# EAGLE design avt953 (EAGLE 6.6.0)
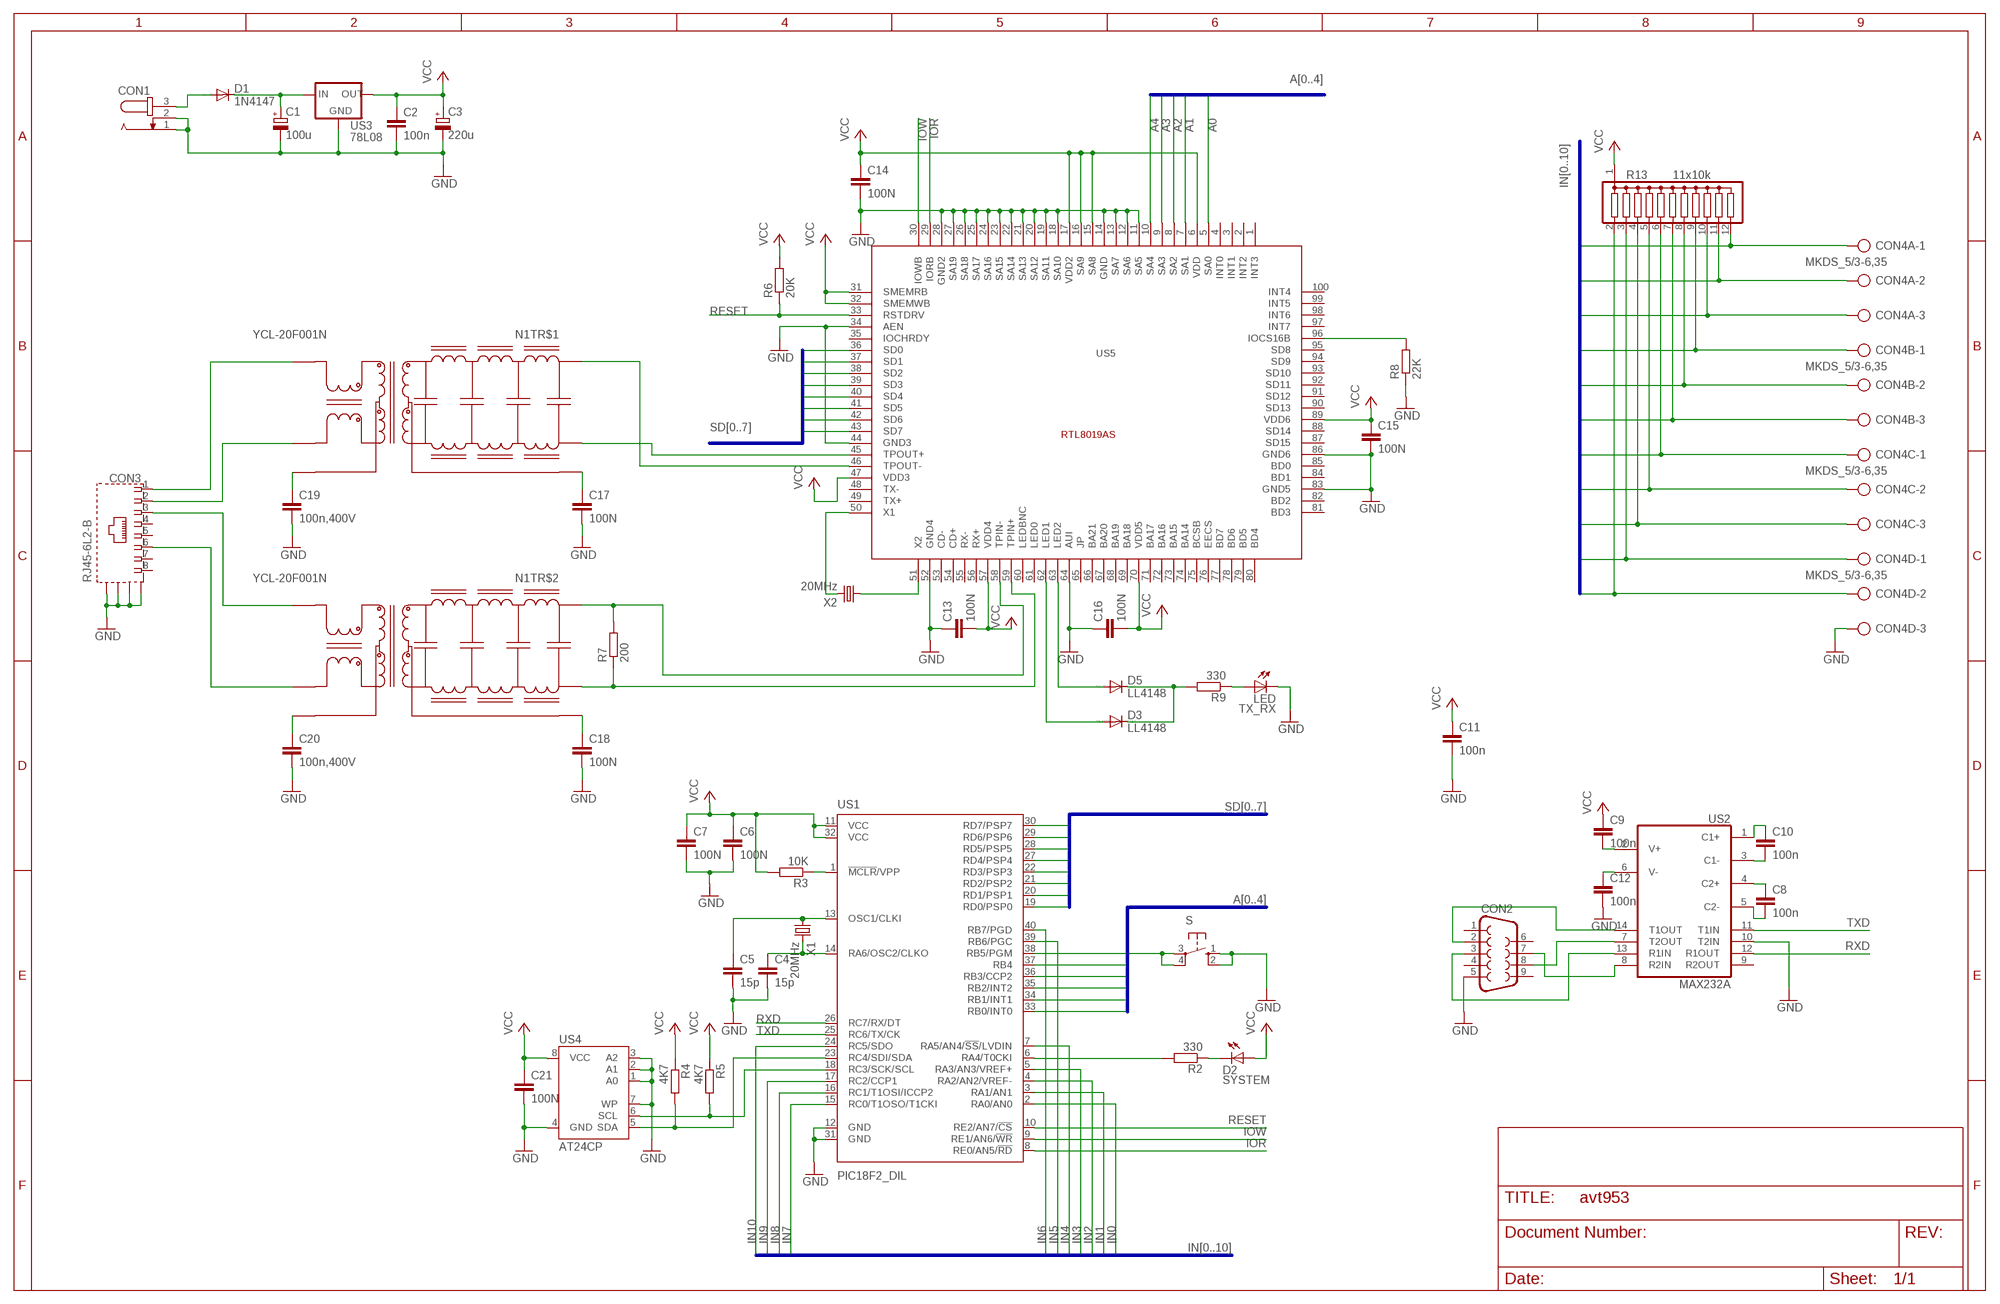
[diagram p0: schematic, sheet 1]

## Parts
C1  100u  CPOL-EUTT2D5  [TT2D5]
C2  100n  C-EUC1206K  [C1206K]
C3  220u  CPOL-EUTT2D5  [TT2D5]
C4  15p  C-EUC1206K  [C1206K]
C5  15p  C-EUC1206K  [C1206K]
C6  100N  C-EUC1206K  [C1206K]
C7  100N  C-EUC1206K  [C1206K]
C8  100n  C-EUC1206K  [C1206K]
C9  100n  C-EUC1206K  [C1206K]
C10  100n  C-EUC1206K  [C1206K]
C11  100n  C-EUC1206K  [C1206K]
C12  100n  C-EUC1206K  [C1206K]
C13  100N  C-EUC1206K  [C1206K]
C14  100N  C-EUC1206K  [C1206K]
C15  100N  C-EUC1206K  [C1206K]
C16  100N  C-EUC1206K  [C1206K]
C17  100N  C-EUC1206K  [C1206K]
C18  100N  C-EUC1206K  [C1206K]
C19  100n,400V  C-EU075-032X103  [C075-032X103]
C20  100n,400V  C-EU075-032X103  [C075-032X103]
C21  100N  C-EUC1206K  [C1206K]
CON1  JACK-PLUG0  [SPC4077]
CON2  F09HP  [F09HP]
CON3  RJ45-6L2-B  [RJ45-SHIELD2]
CON4A  MKDS_5/3-6,35  [MKDS_5/3-635]
CON4B  MKDS_5/3-6,35  [MKDS_5/3-635]
CON4C  MKDS_5/3-6,35  [MKDS_5/3-635]
CON4D  MKDS_5/3-6,35  [MKDS_5/3-635]
D1  1N4147  1N4148DO35-10  [DO35-10]
D2  SYSTEM  LED5MM  [LED5MM]
D3  LL4148  CGRM4001-G  [SOD-123_MINI-SMA]
D5  LL4148  CGRM4001-G  [SOD-123_MINI-SMA]
LED  TX_RX  LED5MM  [LED5MM]
N1  YCL-20F001N  [DIP]
R2  330  R-EU_M3216  [M3216]
R3  10K  R-EU_M3216  [M3216]
R4  4K7  R-EU_M3216  [M3216]
R5  4K7  R-EU_M3216  [M3216]
R6  20K  R-EU_M3216  [M3216]
R7  200  R-EU_M3216  [M3216]
R8  22K  R-EU_M3216  [M3216]
R9  330  R-EU_M3216  [M3216]
R13  11x10k  G11R  [SIL12]
S  10-XX  [B3F-10XX]
US1  PIC18F2_DIL  [DIL40]
US2  MAX232A  MAX232ECWE  [SO16L]
US3  78L08  78XXL  [78XXL]
US4  AT24CP  [DIL08]
US5  RTL8019AS  [RTL8019AS]
X1  20MHz  CRYSTALHC49S  [HC49/S]
X2  20MHz  CRYSTALHC49S  [HC49/S]

## Nets
A0: US1.33(RB0/INT0) US5.5(SA0)
A1: US1.34(RB1/INT1) US5.7(SA1)
A2: US1.35(RB2/INT2) US5.8(SA2)
A3: US1.36(RB3/CCP2) US5.9(SA3)
A4: US1.37(RB4) US5.10(SA4)
GND: C1.- C2.2 C3.- C4.2 C5.2 C6.2 C7.2 C11.2 C12.2 C13.1 C14.2 C15.2 C16.1 C17.2 C18.2 C19.2 C20.2 C21.2 CON1.1 CON1.2 CON2.5 CON3.S1(S) CON3.S2(S) CON3.S3(S) CON3.S4(S) CON4D.3 LED.K(C) R8.1 S.1(S) S.2(S1) US1.12(GND) US1.31(GND) US2.10(T2IN) US3.GND US4.1(A0) US4.2(A1) US4.3(A2) US4.4(GND) US4.7(WP) US5.11(SA5) US5.12(SA6) US5.13(SA7) US5.14(GND) US5.18(SA10) US5.19(SA11) US5.20(SA12) US5.21(SA13) US5.22(SA14) US5.23(SA15) US5.24(SA16) US5.25(SA17) US5.26(SA18) US5.27(SA19) US5.28(GND2) US5.34(AEN) US5.44(GND3) US5.52(GND4) US5.64(AUI) US5.83(GND5) US5.86(GND6)
IN0: CON4A.1 R13.12 US1.2(RA0/AN0)
IN1: CON4A.2 R13.11 US1.3(RA1/AN1)
IN2: CON4A.3 R13.10 US1.4(RA2/AN2/VREF-)
IN3: CON4B.1 R13.9 US1.5(RA3/AN3/VREF+)
IN4: CON4B.2 R13.8 US1.7(RA5/AN4/!SS!/LVDIN)
IN5: CON4B.3 R13.7 US1.39(RB6/PGC)
IN6: CON4C.1 R13.6 US1.40(RB7/PGD)
IN7: CON4C.2 R13.5 US1.15(RC0/T1OSO/T1CKI)
IN8: CON4C.3 R13.4 US1.16(RC1/T1OSI/ICCP2)
IN9: CON4D.1 R13.3 US1.17(RC2/CCP1)
IN10: CON4D.2 R13.2 US1.24(RC5/SDO)
IOR: US1.8(RE0/AN5/!RD) US5.29(IORB)
IOW: US1.9(RE1/AN6/!WR) US5.30(IOWB)
N$1: C9.2 US2.2(V+)
N$2: C12.1 US2.6(V-)
N$3: C10.2 US2.3(C1-)
N$4: C10.1 US2.1(C1+)
N$5: C8.1 US2.4(C2+)
N$6: C8.2 US2.5(C2-)
N$7: CON2.2 US2.14(T1OUT)
N$8: CON2.8 US2.7(T2OUT)
N$9: CON2.3 US2.13(R1IN)
N$10: CON2.7 US2.8(R2IN)
N$11: CON1.3 D1.A
N$12: C1.+ D1.C US3.IN
N$13: CON3.1 N1.P$16
N$14: CON3.2 N1.P$14
N$15: CON3.3 N1.P$11
N$16: CON3.6 N1.P$9
N$17: C19.1 N1.P$15
N$18: C20.1 N1.P$10
N$19: C18.1 N1.P$7
N$20: C17.1 N1.P$2
N$21: N1.P$3 US5.45(TPOUT+)
N$22: N1.P$8 R7.1 US5.59(TPIN+)
N$23: N1.P$1 US5.46(TPOUT-)
N$24: US5.50(X1) X2.2
N$25: N1.P$6 R7.2 US5.58(TPIN-)
N$26: D3.A US5.62(LED1)
N$27: R8.2 US5.96(IOCS16B)
N$28: US5.51(X2) X2.1
N$29: D5.A US5.63(LED2)
N$30: D3.C D5.C R9.2
N$31: LED.A R9.1
N$32: C5.1 US1.13(OSC1/CLKI) X1.1
N$33: C4.1 US1.14(RA6/OSC2/CLKO) X1.2
N$34: R4.2 US1.23(RC4/SDI/SDA) US4.5(SDA)
N$35: R3.1 US1.1(!MCLR!/VPP)
N$36: R2.2 US1.6(RA4/T0CKI)
N$37: R5.2 US1.18(RC3/SCK/SCL) US4.6(SCL)
N$38: D2.K(C) R2.1
N$40: S.3(P) S.4(P1) US1.38(RB5/PGM)
RESET: R6.1 US1.10(RE2/AN7/!CS) US5.33(RSTDRV)
RXD: US1.26(RC7/RX/DT) US2.12(R1OUT)
SD0: US1.19(RD0/PSP0) US5.36(SD0)
SD1: US1.20(RD1/PSP1) US5.37(SD1)
SD2: US1.21(RD2/PSP2) US5.38(SD2)
SD3: US1.22(RD3/PSP3) US5.39(SD3)
SD4: US1.27(RD4/PSP4) US5.40(SD4)
SD5: US1.28(RD5/PSP5) US5.41(SD5)
SD6: US1.29(RD6/PSP6) US5.42(SD6)
SD7: US1.30(RD7/PSP7) US5.43(SD7)
TXD: US1.25(RC6/TX/CK) US2.11(T1IN)
VCC: C2.1 C3.+ C6.1 C7.1 C9.1 C11.1 C13.2 C14.1 C15.1 C16.2 C21.1 D2.A R3.2 R4.1 R5.1 R6.2 R13.1 US1.11(VCC) US1.32(VCC) US3.OUT US4.8(VCC) US5.6(VDD) US5.15(SA8) US5.16(SA9) US5.17(VDD2) US5.31(SMEMRB) US5.32(SMEMWB) US5.47(VDD3) US5.57(VDD4) US5.70(VDD5) US5.89(VDD6)
Unconnected: CON2.1 CON2.4 CON2.6 CON2.9 CON3.4 CON3.5 CON3.7 CON3.8 US2.9(R2OUT) US5.1(INT3) US5.2(INT2) US5.3(INT1) US5.4(INT0) US5.35(IOCHRDY) US5.48(TX-) US5.49(TX+) US5.53(CD-) US5.54(CD+) US5.55(RX-) US5.56(RX+) US5.60(LEDBNC) US5.61(LED0) US5.65(JP) US5.66(BA21) US5.67(BA20) US5.68(BA19) US5.69(BA18) US5.71(BA17) US5.72(BA16) US5.73(BA15) US5.74(BA14) US5.75(BCSB) US5.76(EECS) US5.77(BD7) US5.78(BD6) US5.79(BD5) US5.80(BD4) US5.81(BD3) US5.82(BD2) US5.84(BD1) US5.85(BD0) US5.87(SD15) US5.88(SD14) US5.90(SD13) US5.91(SD12) US5.92(SD11) US5.93(SD10) US5.94(SD9) US5.95(SD8) US5.97(INT7) US5.98(INT6) US5.99(INT5) US5.100(INT4)

## Buses
IN[0..10]
A[0..4]
SD[0..7]

## Power pins joined to a net without a drawn wire
GND: US2.15(GND)
VCC: US2.16(VCC)

## Library data of the parts
C1 C3 = resistor:CPOL-EU: POLARIZED CAPACITOR, European symbol
C2 C4-C21 = resistor:C-EU: CAPACITOR, European symbol
CON1 = con-jack:JACK-PLUG: DC POWER JACK Power Jack, DC, Right Angle, Through Hole, Rated 5A at 16VDC, PC Terminals Distributor: Farnell (www.Farnell.de) Drawing: 84N1161.pdf / 84N1162.pdf Manufacturer: SPC Technology (www.spctechnology.com) Type: SPC4077 / SPC 4078; OC_FARNELL: unknown; OC_NEWARK: unknown
CON2 = con-subd:F09: SUB-D; OC_FARNELL: unknown; OC_NEWARK: unknown
CON3 = con-tycoelectronics:RJ45*2: RJ45 Low Profile Shield Type 2 For all RJ45 L, LC, LCT and X Series Models Source: www.tycoelectronics.com .. ENG_DS_1654001_1099_RJ_L_0507.pdf; MPN: RJ45-6L2-B; OC_FARNELL: unknown; OC_NEWARK: 16R6096
CON4A CON4B CON4C CON4D = con-phoenix-mkds_5:MKDS_5/3-: MKDS 5/3-6,35 Source: PHOENIX CONTACT; MF: FARNELL; MPN: 1714968; OC_FARNELL: 3704695; OC_NEWARK: 71C4092
D1 = diode:1N4148: DIODE high speed (Philips)
D2 LED = led:LED: LED OSRAM: - CHIPLED LG R971, LG N971, LY N971, LG Q971, LY Q971, LO R971, LY R971 LH N974, LH R974 LS Q976, LO Q976, LY Q976 LO Q996 - Hyper CHIPLED LW Q18S LB Q993, LB Q99A, LB R99A - SideLED LS A670, LO A670, LY A670, LG A670, LP A670 LB A673, LV A673, LT A673, LW A673 LH A674 LY A675 LS A676, LA A676, LO A676, LY A676, LW A676 LS A679, LY A679, LG A679 - Hyper Micro SIDELED® LS Y876, LA Y876, LO Y876, LY Y876 LT Y87S - SmartLED LW L88C, LW L88S LB L89C, LB L89S, LG L890 LS L89K, LO L89K, LY L89K LS L896, LA L896, LO L896, LY L896 - TOPLED LS T670, LO T670, LY T670, LG T670, LP T670 LSG T670, LSP T670, LSY T670, LOP T670, LYG T670 LG T671, LOG T671, LSG T671 LB T673, LV T673, LT T673, LW T673 LH T674 LS T676, LA T676, LO T676, LY T676, LB T676, LH T676, LSB T676, LW T676 LB T67C, LV T67C, LT T67C, LS T67K, LO T67K, LY T67K, LW E67C LS E67B, LA E67B, LO E67B, LY E67B, LB E67C, LV E67C, LT E67C LW T67C LS T679, LY T679, LG T679 LS T770, LO T770, LY T770, LG T770, LP T770 LB T773, LV T773, LT T773, LW T773 LH T774 LS E675, LA E675, LY E675, LS T675 LS T776, LA T776, LO T776, LY T776, LB T776 LHGB T686 LT T68C, LB T68C - Hyper Mini TOPLED® LB M676 - Mini TOPLED Santana® LG M470 LS M47K, LO M47K, LY M47K Source: http://www.osram.convergy.de LUXEON: - LUMILED® LXK2-PW12-R00, LXK2-PW12-S00, LXK2-PW14-U00, LXK2-PW14-V00 LXK2-PM12-R00, LXK2-PM12-S00, LXK2-PM14-U00 LXK2-PE12-Q00, LXK2-PE12-R00, LXK2-PE12-S00, LXK2-PE14-T00, LXK2-PE14-U00 LXK2-PB12-K00, LXK2-PB12-L00, LXK2-PB12-M00, LXK2-PB14-N00, LXK2-PB14-P00, LXK2-PB14-Q00 LXK2-PR12-L00, LXK2-PR12-M00, LXK2-PR14-Q00, LXK2-PR14-R00 LXK2-PD12-Q00, LXK2-PD12-R00, LXK2-PD12-S00 LXK2-PH12-R00, LXK2-PH12-S00 LXK2-PL12-P00, LXK2-PL12-Q00, LXK2-PL12-R00 Source: www.luxeon.com KINGBRIGHT: KA-3528ASYC Source: www.kingbright.com
D3 D5 = diode:CGRM400*-G: Molded plasitc,JEDEC SOD-123/Mini SMA Source: Comchip CGRM4001-G.pdf
N1 = trafo:YCL-20F001?: YCL-20F00(N)
R2-R9 = resistor:R-EU_: RESISTOR, European symbol
R13 = resistor-sil:G11R: SIL RESISTOR; OC_FARNELL: unknown; OC_NEWARK: unknown
S = switch-omron:10-XX: OMRON SWITCH; MPN: B3F-1000; OC_FARNELL: 176432; OC_NEWARK: 36M3542
US1 = microchip-custom:PIC18F*2_DIL
US2 = maxim:MAX232ECWE: RS232 TRANSCEIVER; MF: MAXIM; MPN: MAX232ECWE+; OC_FARNELL: 9724435; OC_NEWARK: 67K4440
US3 = v-reg:78XXL: VOLTAGE REGULATOR
US4 = atmel:AT24C*: 2-wire serial EEPROM; MPN: AT24C1024BW-SH-B; OC_FARNELL: 1362646; OC_NEWARK: 03P2044
US5 = rtl8019as:RTL8019AS
X1 X2 = crystal:CRYSTAL: CRYSTAL; OC_FARNELL: 1667008; OC_NEWARK: unknown

## Board
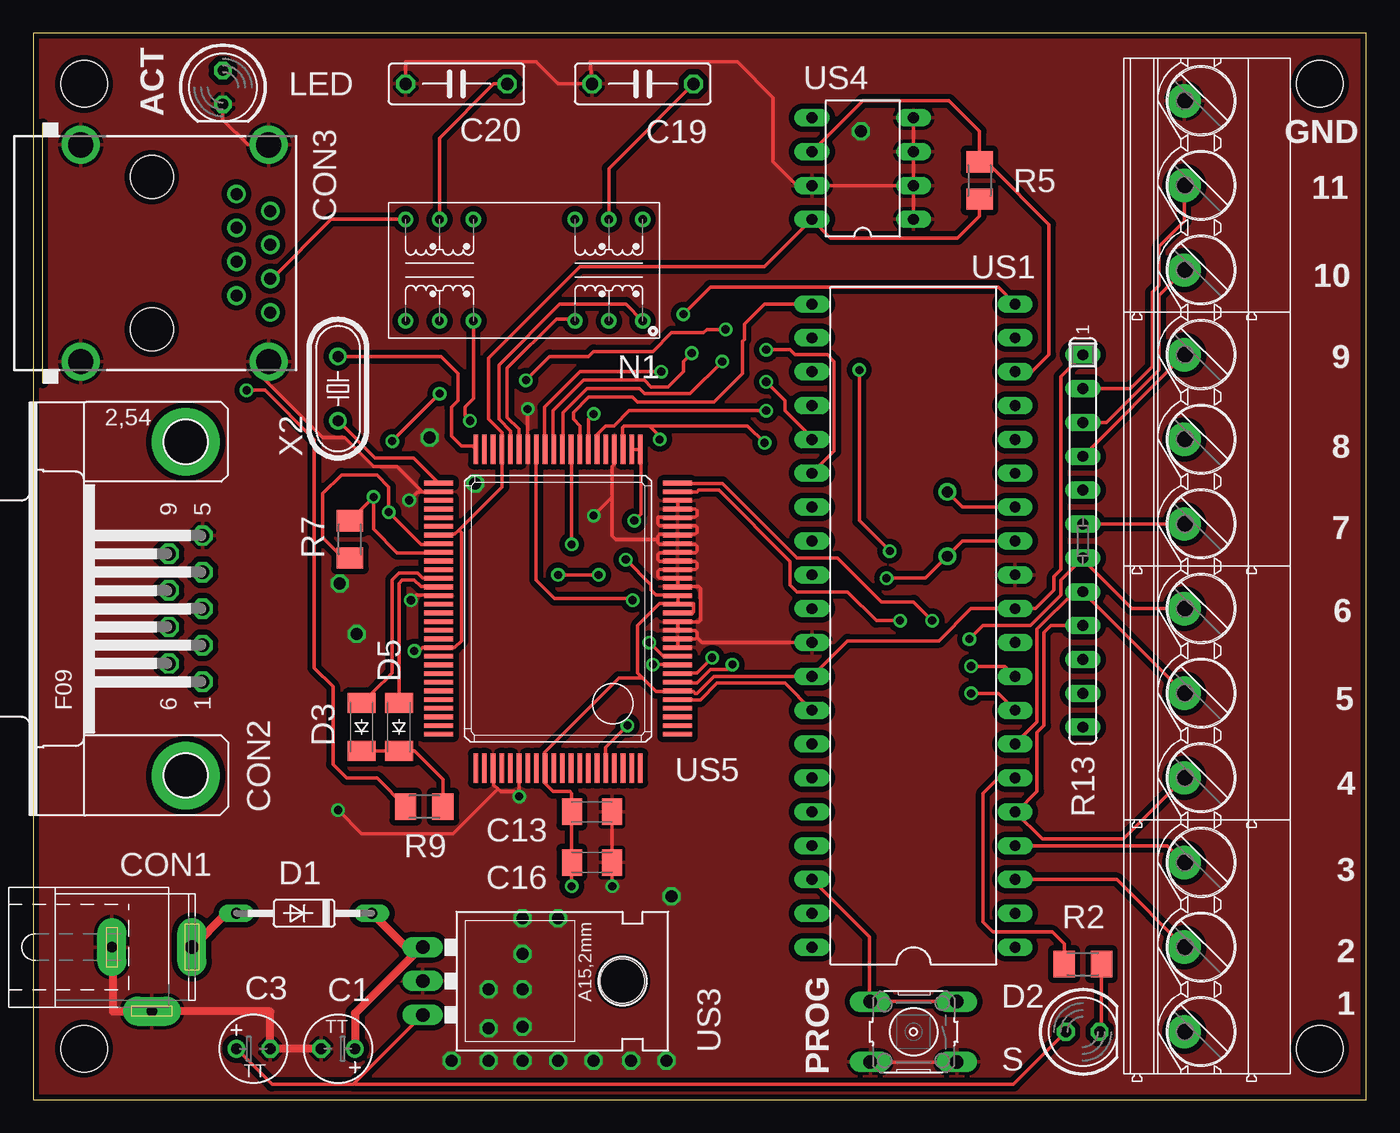
[diagram p1: board, top side]
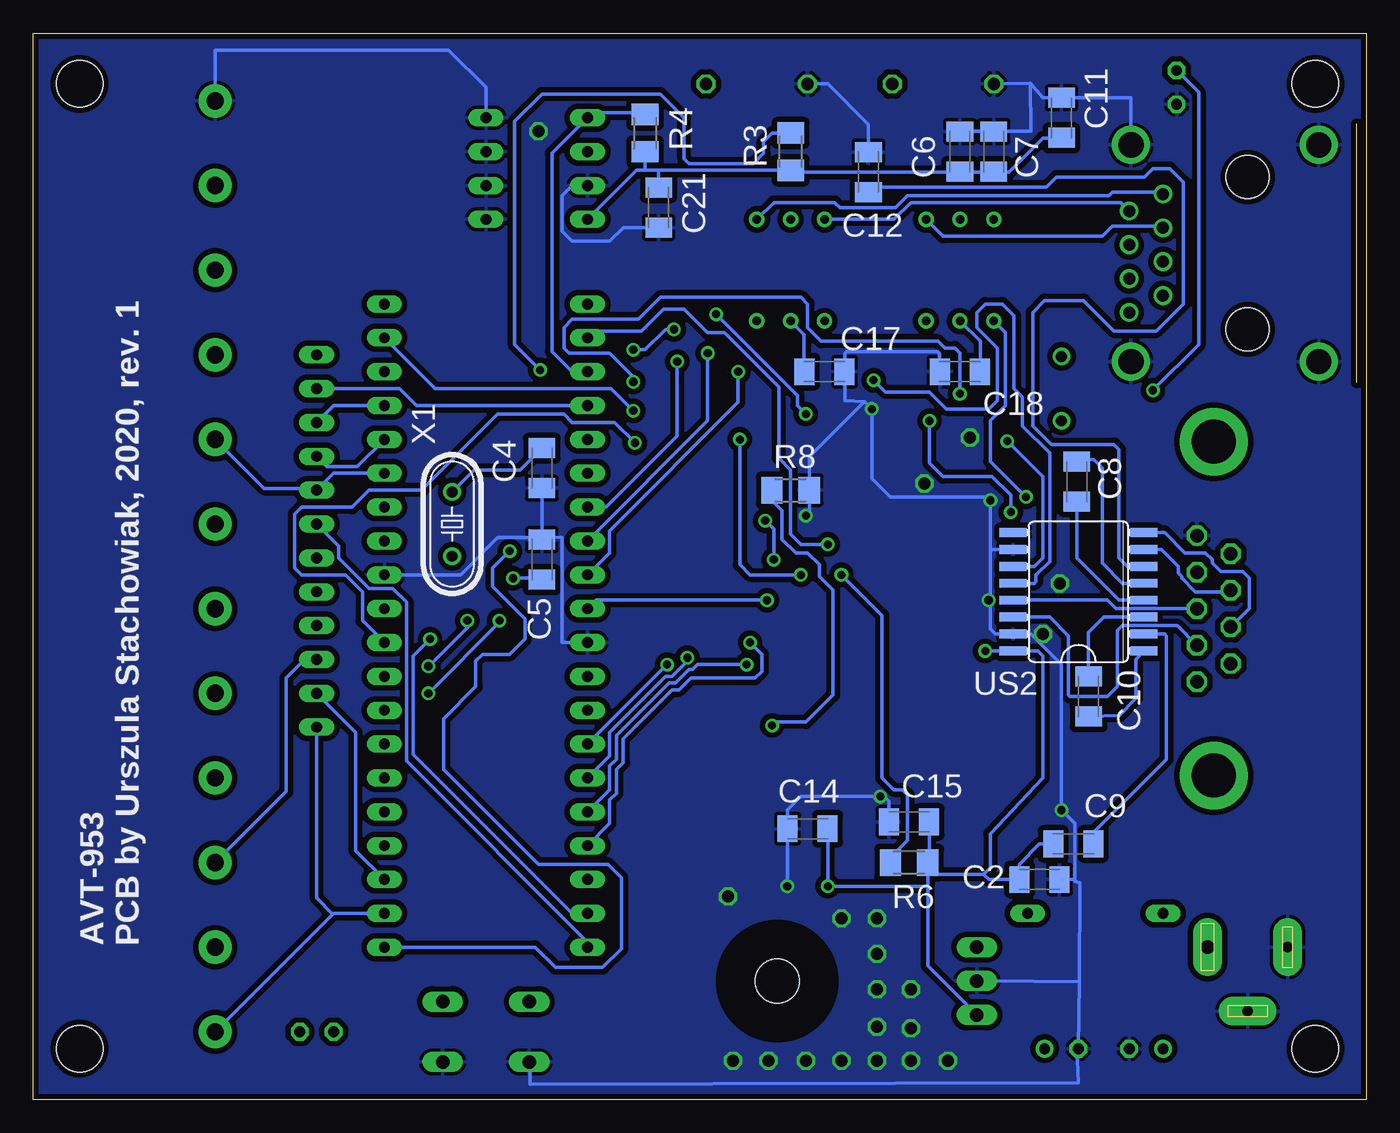
[diagram p2: board, bottom side, seen from below]

Size 100 x 80 mm. Coordinates in mm from the lower left corner, seen from the top.
Outline: 0,0 100,0 100,80 0,80 0,0
Copper layers (1*16): Top 0.035mm / dielectric 1.5mm / Bottom 0.035mm
Design rules "allpcb": minimum track width 6mil, minimum drill 0.25mm, track to track 6mil, track to pad 6mil, pad to pad 6mil, via to via 17mil, smd to smd 0.1mm, copper to edge 0.3mm, drill to drill 8mil, minimum pad ring 10mil, minimum via ring 8mil, stop-mask expansion 4mil, vias tented up to drill 3mm, thermal gap 10mil
Holes 3.5 mm at 3.81,76.2 96.52,76.2 96.52,3.81 3.81,3.81

### Footprints (pad centres in the part's own frame; a part is rotated, then mirrored left to right if it is on the bottom)
TT2D5 = drill 0.813: + -1.27,0 | drill 0.813 octagon: - 1.27,0
C1206K = smd 1.5 x 2: 1 -1.5,0; 2 1.5,0
C075-032X103 = drill 0.914 octagon: 1 -3.81,0; 2 3.81,0
SPC4077 = drill 0.8 pad 2.184 long: 1 -3,0; 2 0,-4.8 | drill 1 pad 2.184 long: 3 3,0
F09HP = drill 1.016 octagon: 1 -5.486,-1.27; 2 -2.743,-1.27; 3 0,-1.27; 4 2.743,-1.27; 5 5.486,-1.27; 6 -4.115,1.27; 7 -1.372,1.27; 8 1.372,1.27; 9 4.115,1.27 | drill 3.302 pad 5.08: G1 -12.522,0; G2 12.522,0
RJ45-SHIELD2 = drill 0.9 pad 1.4: 1 -4.445,6.35; 2 -3.175,8.89; 3 -1.905,6.35; 4 -0.635,8.89; 5 0.635,6.35; 6 1.905,8.89; 7 3.175,6.35; 8 4.445,8.89 | drill 1.9 pad 2.5: S1 -8.128,-5.33; S2 8.128,-5.33; S3 -8.128,8.76; S4 8.128,8.76 | hole 3.251: -5.715,0; 5.715,0
MKDS_5/3-635 = drill 1.3 pad 2.5: 1 -6.35,0; 2 0,0; 3 6.35,0
DO35-10 = drill 0.813 long: A 5.08,0; C -5.08,0
LED5MM = drill 0.813 octagon: A -1.27,0; K 1.27,0
SOD-123_MINI-SMA = smd 1.5 x 2.1: A 1.8,0; C -1.8,0
DIP = drill 0.635: P$1 -8.89,3.81; P$2 -6.35,3.81; P$3 -3.81,3.81; P$6 3.81,3.81; P$7 6.35,3.81; P$8 8.89,3.81; P$9 8.89,-3.81; P$10 6.35,-3.81; P$11 3.81,-3.81; P$14 -3.81,-3.81; P$15 -6.35,-3.81; P$16 -8.89,-3.81
M3216 = smd 1.6 x 2: 1 -1.4,0; 2 1.4,0
SIL12 = drill 0.813 long: 1 -13.97,0; 2 -11.43,0; 3 -8.89,0; 4 -6.35,0; 5 -3.81,0; 6 -1.27,0; 7 1.27,0; 8 3.81,0; 9 6.35,0; 10 8.89,0; 11 11.43,0; 12 13.97,0
B3F-10XX = drill 1.016 long: 1 -3.251,2.261; 2 3.251,2.261; 3 -3.251,-2.261; 4 3.251,-2.261
DIL40 = drill 0.813 long: 1 -24.13,-7.62; 2 -21.59,-7.62; 3 -19.05,-7.62; 4 -16.51,-7.62; 5 -13.97,-7.62; 6 -11.43,-7.62; 7 -8.89,-7.62; 8 -6.35,-7.62; 9 -3.81,-7.62; 10 -1.27,-7.62; 11 1.27,-7.62; 12 3.81,-7.62; 13 6.35,-7.62; 14 8.89,-7.62; 15 11.43,-7.62; 16 13.97,-7.62; 17 16.51,-7.62; 18 19.05,-7.62; 19 21.59,-7.62; 20 24.13,-7.62; 21 24.13,7.62; 22 21.59,7.62; 23 19.05,7.62; 24 16.51,7.62; 25 13.97,7.62; 26 11.43,7.62; 27 8.89,7.62; 28 6.35,7.62; 29 3.81,7.62; 30 1.27,7.62; 31 -1.27,7.62; 32 -3.81,7.62; 33 -6.35,7.62; 34 -8.89,7.62; 35 -11.43,7.62; 36 -13.97,7.62; 37 -16.51,7.62; 38 -19.05,7.62; 39 -21.59,7.62; 40 -24.13,7.62
SO16L = smd 0.66 x 2.032: 1 -4.445,-4.902; 2 -3.175,-4.902; 3 -1.905,-4.902; 4 -0.635,-4.902; 5 0.635,-4.902; 6 1.905,-4.902; 7 3.175,-4.902; 8 4.445,-4.902; 9 4.445,4.902; 10 3.175,4.902; 11 1.905,4.902; 12 0.635,4.902; 13 -0.635,4.902; 14 -1.905,4.902; 15 -3.175,4.902; 16 -4.445,4.902
78XXL = drill 1.016 long: GND 0,-3.81; IN -2.54,-3.81; OUT 2.54,-3.81 | hole 3.302: 0,11.176
DIL08 = drill 0.813 long: 1 -3.81,-3.81; 2 -1.27,-3.81; 3 1.27,-3.81; 4 3.81,-3.81; 5 3.81,3.81; 6 1.27,3.81; 7 -1.27,3.81; 8 -3.81,3.81
RTL8019AS = smd 0.35 x 2.2: 1 -9.425,-8.965; 2 -8.775,-8.965; 3 -8.125,-8.965; 4 -7.475,-8.965; 5 -6.825,-8.965; 6 -6.175,-8.965; 7 -5.525,-8.965; 8 -4.875,-8.965; 9 -4.225,-8.965; 10 -3.575,-8.965; 11 -2.925,-8.965; 12 -2.275,-8.965; 13 -1.625,-8.965; 14 -0.975,-8.965; 15 -0.325,-8.965; 16 0.325,-8.965; 17 0.975,-8.965; 18 1.625,-8.965; 19 2.275,-8.965; 20 2.925,-8.965; 21 3.575,-8.965; 22 4.225,-8.965; 23 4.875,-8.965; 24 5.525,-8.965; 25 6.175,-8.965; 26 6.825,-8.965; 27 7.475,-8.965; 28 8.125,-8.965; 29 8.775,-8.965; 30 9.425,-8.965; 51 9.425,8.965; 52 8.775,8.965; 53 8.125,8.965; 54 7.475,8.965; 55 6.825,8.965; 56 6.175,8.965; 57 5.525,8.965; 58 4.875,8.965; 59 4.225,8.965; 60 3.575,8.965; 61 2.925,8.965; 62 2.275,8.965; 63 1.625,8.965; 64 0.975,8.965; 65 0.325,8.965; 66 -0.325,8.965; 67 -0.975,8.965; 68 -1.625,8.965; 69 -2.275,8.965; 70 -2.925,8.965; 71 -3.575,8.965; 72 -4.225,8.965; 73 -4.875,8.965; 74 -5.525,8.965; 75 -6.175,8.965; 76 -6.825,8.965; 77 -7.475,8.965; 78 -8.125,8.965; 79 -8.775,8.965; 80 -9.425,8.965 | smd 2.2 x 0.35: 31 11.965,-6.175; 32 11.965,-5.525; 33 11.965,-4.875; 34 11.965,-4.225; 35 11.965,-3.575; 36 11.965,-2.925; 37 11.965,-2.275; 38 11.965,-1.625; 39 11.965,-0.975; 40 11.965,-0.325; 41 11.965,0.325; 42 11.965,0.975; 43 11.965,1.625; 44 11.965,2.275; 45 11.965,2.925; 46 11.965,3.575; 47 11.965,4.225; 48 11.965,4.875; 49 11.965,5.525; 50 11.965,6.175; 81 -11.965,6.175; 82 -11.965,5.525; 83 -11.965,4.875; 84 -11.965,4.225; 85 -11.965,3.575; 86 -11.965,2.925; 87 -11.965,2.275; 88 -11.965,1.625; 89 -11.965,0.975; 90 -11.965,0.325; 91 -11.965,-0.325; 92 -11.965,-0.975; 93 -11.965,-1.625; 94 -11.965,-2.275; 95 -11.965,-2.925; 96 -11.965,-3.575; 97 -11.965,-4.225; 98 -11.965,-4.875; 99 -11.965,-5.525; 100 -11.965,-6.175
HC49/S = drill 0.813: 1 -2.413,0; 2 2.413,0

### Placement (x,y rotation side)
C1  22.86,3.81 180 top
C2  24.51,16.51 0 bottom
C3  16.51,3.81 0 top
C4  61.85,47.37 270 bottom
C5  61.85,40.51 90 bottom
C6  30.48,71.12 90 bottom
C7  27.94,71.12 90 bottom
C8  21.72,46.35 90 bottom
C9  21.97,19.18 0 bottom
C10  20.83,30.23 90 bottom
C11  22.86,73.66 90 bottom
C12  37.34,69.6 90 bottom
C13  41.91,21.59 180 top
C14  41.91,20.32 180 bottom
C15  34.29,20.83 180 bottom
C16  41.91,17.78 180 top
C17  40.64,54.61 0 bottom
C18  30.48,54.61 180 bottom
C19  45.72,76.2 180 top
C20  31.75,76.2 180 top
C21  53.09,66.93 270 bottom
CON1  8.89,11.43 0 top
CON2  11.43,36.83 90 top
CON3  8.89,63.5 270 top
CON4A  86.36,11.43 90 top
CON4B  86.36,30.48 90 top
CON4C  86.36,49.53 90 top
CON4D  86.36,68.58 90 top
D1  20.32,13.97 180 top
D2  78.74,5.08 0 top
D3  24.64,27.94 90 top
D5  27.43,27.94 90 top
LED  14.22,75.95 270 top
N1  36.83,62.23 180 top
R2  78.74,10.16 180 top
R3  43.18,71.12 270 bottom
R4  54.1,72.52 90 bottom
R5  70.99,68.96 90 top
R6  34.29,17.78 0 bottom
R7  23.75,42.04 270 top
R8  43.18,45.72 180 bottom
R9  29.34,21.97 0 top
R13  78.74,41.91 270 top
S  66.04,5.08 180 top
US1  66.04,35.56 90 top
US2  21.59,38.1 90 bottom
US3  33.02,8.89 270 top
US4  62.23,69.85 90 top
US5  39.37,36.83 90 top
X1  68.58,43.18 90 bottom
X2  22.86,53.34 90 top

### Tracks (layer width: path | path; a pad name or v marks a point on that pad's centre or on a via)
A0
  Top 0.254: US1.33 56.39,31.24 51.31,31.24 50.04,29.97 48.39,29.97 US5.5
A1  (via drill 0.61)
  Top 0.254: v52.45,32.64 52.07,32.26 50.8,32.26 49.78,31.24 48.39,31.24 US5.7
  Bottom 0.254: US1.34 v52.45,32.64
A2  (via drill 0.61)
  Top 0.254: v50.93,33.15 49.78,32 48.39,32 US5.8
  Bottom 0.254: v50.93,33.15 50.93,32.89 52.07,31.75 52.58,31.75 56.77,27.56 56.77,25.78 US1.35
A3  (via drill 0.61)
  Top 0.254: v46.48,32.64 48.26,32.64 US5.9
  Bottom 0.254: v46.48,32.64 50.16,32.64 50.55,32.26 50.8,32.26 51.82,31.24 52.32,31.24 56.26,27.3 56.26,25.53 56.77,25.02 56.77,23.24 US1.36
A4  (via drill 0.61)
  Top 0.254: v46.23,34.29 47.24,33.27 48.26,33.27 US5.10
  Bottom 0.254: v46.23,34.29 45.34,33.4 45.34,32.13 45.85,31.62 50.67,31.62 51.56,30.73 52.07,30.73 55.75,27.05 55.75,25.27 56.26,24.77 56.26,22.99 56.77,22.48 56.77,20.7 US1.37
GND  (via drill 0.61, 0.9)
  Top 0.254: US4.2 US4.1 | US4.4 US4.3 US4.2 | US4.2 US4.7 57.28,68.58 55.5,70.36 55.5,75.18 52.83,77.85 41.78,77.85 C19.2 39.37,76.2 37.72,77.85 27.94,77.85 C20.2 | CON3.S3 16.13,71.63 14.22,73.53 LED.K | 30.35,37.85 US5.64 30.36,37.85 28.7,37.85 v28.32,37.47 | 29.21,45.59 30.35,45.59 US5.52 30.48,45.59 | US5.44 37.08,48.9 v37.08,51.82 | 48.51,34.54 48.39,34.42 48.39,33.91 US5.11 | 48.51,34.54 48.39,34.67 US5.12 48.51,34.54 | 49.78,34.67 49.78,35.05 49.66,35.18 48.39,35.18 US5.13 48.39,35.31 48.39,35.81 US5.14 48.51,35.81 49.91,35.81 50.04,35.94 50.04,38.35 49.91,38.48 48.51,38.48 US5.18 48.39,38.48 48.39,38.99 US5.19 48.26,39.12 46.99,39.12 46.86,39.24 46.86,39.62 46.99,39.75 48.26,39.75 US5.20 48.39,39.75 49.66,39.75 49.78,39.88 49.78,40.26 49.66,40.39 48.39,40.39 US5.21 48.26,40.39 46.99,40.39 46.86,40.51 46.86,40.89 46.99,41.02 48.26,41.02 US5.22 48.39,41.02 49.66,41.02 49.78,41.15 49.78,41.53 49.66,41.66 48.39,41.66 US5.23 48.26,41.66 46.99,41.66 46.86,41.78 46.86,42.04 | 49.78,34.67 49.66,34.54 48.51,34.54 | US1.31 50.16,34.29 49.78,34.67 | 46.86,42.04 46.86,42.29 46.99,42.42 48.26,42.42 US5.24 48.39,42.42 49.66,42.42 49.78,42.55 49.78,42.93 49.66,43.05 48.39,43.05 US5.25 48.26,43.05 46.99,43.05 46.86,43.18 46.86,43.69 48.26,43.69 US5.26 48.39,43.69 49.66,43.69 49.78,43.81 49.78,44.2 49.66,44.32 48.39,44.32 US5.27 48.39,44.45 48.39,44.83 US5.28 | US5.34 43.56,48.77 43.56,47.62 43.43,47.5 43.43,45.21 | 43.43,17.78 43.43,21.59 C13.1 | 43.43,17.78 v43.43,16 | 43.43,17.78 C16.1 | US5.86 36.45,24.77 v36.45,22.73 36.07,23.11 35.05,23.11 34.86,23.3
  Top 0.254: 34.86,23.3 34.54,23.62 34.54,24.77 US5.83 | 5.97,11.43 CON1.1 | S.2 62.87,2.79 69.22,2.79 S.1 | 8.89,6.6 CON1.2 | 34.86,23.3 31.5,19.94 24.64,19.94 v22.86,21.72 | CON3.S4 16.38,55.37 16.38,54.99 21.72,49.66 23.37,49.66 25.53,47.5 27.3,47.5 29.21,45.59 | 29.21,45.59 28.83,45.59 v28.19,44.96 | v42.04,43.81 43.43,45.21 | 43.43,45.21 43.43,42.29 43.69,42.04 46.86,42.04
  Top 0.61: CON1.2 5.97,6.6 5.97,11.43 | C1.- C3.- 17.78,6.6 8.89,6.6
  Bottom 0.254: CON4D.3 86.36,78.74 68.83,78.74 66.04,75.95 US4.4 | 22.86,75.18 24.26,75.18 25.21,76.26 | 25.21,76.26 25.15,72.64 27.94,72.64 | 27.94,72.64 30.48,72.64 C6.2 | 27.94,72.64 C7.2 | 25.21,76.26 C20.2 | CON3.S3 17.65,75.18 22.86,75.18 | 22.86,75.18 C11.2 | 53.34,65.79 C21.2 55.73,65.43 56.77,64.39 59.56,64.39 60.33,65.15 60.33,67.82 59.56,68.58 US4.7 | 62.1,42.16 61.98,42.16 C5.2 | 62.04,42.23 61.85,42.16 C4.2 | 62.04,42.23 62.1,42.16 | US1.12 67.94,39.37 65.15,42.16 62.1,42.16 | 28.19,37.47 28.19,41.15 28.13,41.21 | 28.19,37.47 28.19,35.31 27.81,34.92 US2.15 25.15,34.92 22.86,32.64 v22.86,21.72 21.84,20.7 21.84,16.38 | 28.13,41.21 28.07,41.27 US2.10 | 28.19,37.47 v28.32,37.47 | 28.13,41.21 28.19,41.27 v28.19,44.96 28.45,45.21 35.69,45.21 37.08,46.61 v37.08,51.82 37.66,52.39 | 39.12,54.61 39.12,56.01 38.99,56.13 32.13,56.13 32,56.01 32,54.61 C18.2 | 37.66,52.39 39.12,52.45 39.12,54.61 | 39.12,54.61 C17.2 | R8.1 41.78,44.07 v42.04,43.81 | 37.66,52.39 41.78,48.26 R8.1 | R8.1 | US1.31 60.33,34.29 60.33,42.16 62.04,42.23 | v43.43,16 43.43,20.32 | C15.2 35.81,20.83 35.81,22.35 36.2,22.73 v36.45,22.73 42.42,22.73 43.43,21.72 43.43,20.32 | 43.43,20.32 C14.2 | 21.84,16.38 21.46,16.26 21.53,8.83 | 21.53,8.83 28.32,8.89 US3.GND | 21.53,8.83 C1.- 21.72,3.81 21.59,1.27 62.74,1.14 62.74,2.79 S.2 | C2.2 21.97,16.51 21.84,16.38 | 37.34,71.63 C12.2 37.34,73.15 40.39,76.2 C19.2
  other vias: 62.1,72.64 33.15,46.23 29.72,49.66 24.26,34.92 36.7,13.59 36.7,10.92 36.7,8.26 36.7,5.46 36.7,2.92 39.37,2.92 42.04,2.92 44.83,2.92 47.5,2.92 47.88,15.24 39.37,13.59 34.16,2.92 31.37,2.92 34.16,5.33 34.16,8.26 22.99,38.73
  pour Top (isolate 0.406): 0,0 0,80.01 100.08,80.01 100.08,0
  pour Bottom (isolate 0.406): 0,80.01 100.08,80.01 100.08,0 0,0 0,11.56
IN0
  Bottom 0.254: US1.2 77.47,13.97 77.53,13.91 | CON4A.1 77.53,13.91 | R13.12 78.74,15.11 77.53,13.91
IN1
  Top 0.254: US1.3 81.28,16.51 CON4A.2
  Bottom 0.254: US1.3 75.82,18.67 75.82,27.56 R13.11
IN2
  Top 0.254: US1.4 85.09,19.05 CON4A.3
  Bottom 0.254: R13.10 79.63,33.02 81.03,31.62 81.03,23.11 CON4A.3
IN3
  Top 0.254: CON4B.1 81.79,19.56 75.69,19.56 US1.5 73.79,21.59 75.31,23.11 75.31,27.56 75.82,28.07 75.82,35.05 76.33,35.56 R13.9
IN4
  Top 0.254: US1.7 75.31,28.32 75.31,35.31 78.11,38.1 R13.8 CON4B.2
IN5  (via drill 0.61)
  Top 0.254: v70.23,34.54 71.25,35.56 74.8,35.56 77.09,37.85 77.09,38.99 R13.7 78.74,40.51 82.42,36.83 CON4B.3
  Bottom 0.254: US1.39 59.56,13.97 71.5,25.91 71.5,33.27 v70.23,34.54
IN6
  Top 0.254: R13.6 CON4C.1
  Bottom 0.254: US1.40 58.42,11.81 72.01,25.4 72.01,37.34 73.03,38.35 74.8,38.35 77.09,40.64 77.09,41.53 R13.6
IN7
  Bottom 0.254: US1.15 77.47,46.99 R13.5 78.74,45.85 82.68,45.85 CON4C.2
IN8
  Top 0.254: CON4C.3 R13.4
  Bottom 0.254: US1.16 75.69,47.5 77.98,47.5 R13.4
IN9
  Top 0.254: R13.3 80.52,50.8 84.45,54.74 84.45,60.33 CON4D.1
  Bottom 0.254: US1.17 77.47,52.07 R13.3
IN10
  Top 0.254: CON4D.2 86.36,65.91 84.45,64.01 84.45,61.09 83.95,60.58 83.95,54.99 82.3,53.34 R13.2
  Bottom 0.254: US1.24 71.25,52.07 72.52,53.34 R13.2
IOR  (via drill 0.61)
  Top 0.254: v65.02,35.94 63.25,35.94 61.09,38.1 57.28,38.1 56.77,38.61 56.77,40.39 51.44,45.72 49.91,45.72 49.78,45.59 48.39,45.59 US5.29 | v70.36,30.48 72.39,30.48 US1.8
  Bottom 0.254: v65.02,35.94 65.02,35.81 v70.36,30.48
IOW  (via drill 0.61)
  Top 0.254: v70.36,32.51 72.9,32.51 US1.9 | US5.30 48.39,46.23 51.69,46.23 57.28,40.64 60.33,40.64 63.63,37.34 66.04,37.34 v67.44,35.94
  Bottom 0.254: v67.44,35.94 67.44,35.43 v70.36,32.51
N$1
  Bottom 0.254: US2.2 15.11,34.92 14.99,34.8 14.99,25.53 20.47,20.04 C9.2 20.47,19.79 20.32,19.94
N$2
  Bottom 0.254: US2.6 17.91,40.01 18.54,40.64 18.54,48.77 18.92,49.15 23.62,49.15 25.02,50.55 25.02,59.05 24.13,59.94 21.21,59.94 18.92,57.66 15.75,57.66 13.72,59.69 13.72,68.83 14.73,69.85 16,69.85 16.64,69.22 23.24,69.22 24,68.45 36.98,68.45 C12.1
N$3
  Bottom 0.254: US2.3 19.68,36.2 20.83,35.05 C10.2
N$4
  Bottom 0.254: US2.1 17.27,33.02 17.27,30.1 18.52,28.83 C10.1
N$5
  Bottom 0.254: C8.1 21.72,40.64 18.54,37.47 US2.4
N$6
  Bottom 0.254: C8.2 21.72,48.01 20.45,48.01 19.81,47.37 19.81,40.26 18.29,38.73 US2.5
N$7
  Bottom 0.254: US2.14 23.75,36.2 22.35,34.8 22.35,30.35 22.23,30.23 19.43,30.23 18.67,30.99 18.67,35.18 18.29,35.56 14.17,35.56 CON2.2
N$8
  Bottom 0.254: US2.7 15.37,41.27 14.1,40.01 14.1,39.5 13.84,39.24 13.84,39.12 12.83,38.1 10.16,38.1 CON2.8
N$9
  Bottom 0.254: US2.13 19.43,37.47 18.8,36.83 CON2.3
N$10
  Bottom 0.254: US2.8 15.11,42.55 13.59,41.02 12.06,41.02 11.56,40.51 11.56,40.26 10.92,39.62 9.27,39.62 8.76,39.12 8.76,36.85 CON2.7
N$11
  Top 0.61: D1.A 14.48,13.97 11.94,11.43 CON1.3
N$12
  Top 0.254: 28.45,10.92 US3.IN
  Top 0.61: C1.+ 24.13,6.48 29.08,11.43 US3.IN | 28.45,10.92 D1.C
N$13
  Bottom 0.254: CON3.1 15.37,68.07 19.05,68.07 19.3,67.82 34.42,67.82 35.31,66.93 39.5,66.93 39.88,67.31 44.45,67.31 N1.P$16
N$14
  Bottom 0.254: CON3.2 18.41,67.31 34.16,67.31 35.43,66.04 N1.P$14
N$15
  Bottom 0.254: N1.P$11 31.75,64.77 19.81,64.77 19.05,65.53 15.37,65.53 CON3.3
N$16
  Top 0.254: N1.P$9 22.35,66.04 17.91,61.59 CON3.6
N$17
  Top 0.254: N1.P$15 43.18,69.85 C19.1
N$18
  Top 0.254: N1.P$10 30.48,72.14 34.54,76.2 C20.1
N$19
  Bottom 0.254: N1.P$7 28.96,56.9 28.96,54.61 C18.1
N$20
  Bottom 0.254: N1.P$2 42.16,57.4 42.16,54.61 C17.1
N$21
  Top 0.254: US5.45 36.45,48.9 36.45,50.29 35.56,51.18 35.56,54.86 39.24,58.55 40.51,58.55 N1.P$3
N$22  (via drill 0.61)
  Top 0.254: US5.59 30.35,41.02 27.3,41.02 25.53,42.8 v25.53,45.21 R7.1
  Bottom 0.254: N1.P$8 27.05,57.53 27.05,52.07 28.19,50.93 28.19,47.88 v25.53,45.21
N$23
  Top 0.254: N1.P$1 44.45,59.69 39.5,59.69 34.92,55.12 34.92,51.05 35.81,50.16 35.81,48.9 US5.46
N$24
  Top 0.254: X2.2 30.61,55.75 31.88,54.48 31.88,52.45 31.37,51.94 31.37,49.78 32.13,49.02 32.97,49.02 US5.50 33.15,48.9
N$25  (via drill 0.61)
  Top 0.254: US5.58 30.35,41.66 29.08,41.66 v26.67,44.07 26.67,45.97 25.78,46.86 23.11,46.86 21.72,45.47 21.72,42.16 23.24,40.64 R7.2 | N1.P$6 33.02,52.58 32.38,51.94 32.38,51.31 v32.77,50.93
  Bottom 0.254: v26.67,44.07 26.67,45.34 28.07,46.74 31.75,46.74 32.77,47.75 v32.77,50.93
N$26
  Top 0.254: US5.62 30.35,39.12 29.21,39.12 28.83,39.5 27.43,39.5 26.92,38.99 26.92,32 26.42,31.5 26.01,31.11 D3.A
N$27  (via drill 0.61)
  Top 0.254: v44.58,28.07 42.93,26.42 42.93,24.89 US5.96
  Bottom 0.254: R8.2 44.58,44.96 43.81,44.2 43.81,42.04 42.8,41.02 41.91,41.02 41.02,40.13 41.02,39.24 40.01,38.23 40.01,30.35 42.04,28.32 44.32,28.32 v44.58,28.07
N$28
  Top 0.254: 30.35,46.23 US5.51 28.53,48.13 25.65,48.13 X2.1
N$29
  Top 0.254: D5.A 27.43,38.73 27.69,38.99 28.57,38.99 29.08,38.48 30.35,38.48 US5.63
N$30
  Top 0.254: R9.2 30.73,24 28.6,26.14 D5.C D3.C
N$31  (via drill 0.61)
  Top 0.254: v16,53.21 17.4,53.21 21.08,49.53 21.08,32.38 22.48,30.99 22.48,25.15 23.5,24.13 25.78,24.13 R9.1
  Bottom 0.254: v16,53.21 12.57,56.64 12.57,75.56 LED.A
N$32  (via drill 0.61)
  Top 0.254: v64.01,39.12 66.93,39.12 X1.1 69.72,41.91 US1.13
  Bottom 0.254: v64.01,39.12 61.85,39.12 C5.1
N$33
  Top 0.254: US1.14 69.72,44.45 X1.2
  Bottom 0.254: X1.2 66.93,47.24 63.5,47.24 C4.1
N$34
  Bottom 0.254: 53.34,73.79 R4.2 54.23,74.04 57.91,74.04 58.29,73.66 US4.5 61.09,70.99 61.09,56.13 59.56,54.61 US1.23
N$35  (via drill 0.61)
  Top 0.254: v61.98,54.74 61.98,43.43 v64.26,41.15
  Bottom 0.254: v61.98,54.74 63.88,56.64 63.88,73.41 61.85,75.44 52.96,75.44 51.18,73.66 51.18,70.61 50.8,70.23 45.97,70.23 45.21,70.99 45.21,71.88 44.58,72.52 R3.1 | v64.26,41.15 65.53,39.88 65.53,38.48 63.12,36.07 63.12,34.54 64.26,33.4 66.29,33.4 66.8,32.89 66.8,30.99 69.22,28.57 69.22,24.77 62.1,17.65 56.9,17.65 55.88,16.64 55.88,11.3 57.28,9.91 60.83,9.91 62.36,11.43 US1.1
N$36
  Top 0.254: R2.2 77.34,11.68 76.45,12.57 72.01,12.57 71.25,13.34 71.25,22.99 72.39,24.13 US1.6
N$37
  Top 0.254: US4.6 62.23,74.93 68.71,74.93 70.99,72.64 R5.2 71.38,69.98 71.88,69.98 76.2,65.66 76.2,55.88 74.93,54.61 US1.18
N$38
  Top 0.254: D2.K 80.14,5.21 R2.1
N$40
  Top 0.254: US1.38 62.74,12.19 62.74,7.37 S.4 62.87,7.37 69.22,7.37 S.3
RESET  (via drill 0.61)
  Top 0.254: v42.42,39.37 v39.37,39.37 | 46.23,50.55 44.32,50.55 44.2,50.42 44.2,48.9 US5.33 | 46.23,50.55 53.59,50.55 v54.86,49.28 | v46.99,49.53 46.99,49.78 46.23,50.55
  Bottom 0.254: v39.37,39.37 36.32,36.32 36.32,24.13 35.43,23.24 34.8,23.24 34.42,22.86 34.42,19.43 35.69,18.16 R6.1 | v42.42,39.37 46.23,39.37 46.99,40.13 v46.99,49.53 | US1.10 75.31,35.94 75.31,38.1 76.58,39.37 79.88,39.37 80.39,39.88 80.39,43.94 79.88,44.45 76.07,44.45 74.8,45.72 70.87,45.72 65.15,51.44 60.2,51.44 59.56,50.8 56.39,50.8 v54.86,49.28
RXD  (via drill 0.61)
  Top 0.254: US1.26 60.07,48.64 60.07,55.37 59.56,55.88 57.15,55.88 56.77,56.26 v54.99,56.26 | v36.96,53.98 38.73,55.75 41.66,55.75 42.04,56.13 46.48,56.13 47.88,57.53 50.29,57.53 50.55,57.78 v51.94,57.78
  Bottom 0.254: US2.12 24.89,38.73 24.77,38.86 24.77,39.37 23.75,40.39 23.75,48.51 25.78,50.55 25.78,52.7 26.42,53.34 26.42,58.8 27.3,59.69 28.57,59.69 29.21,59.05 29.21,57.91 27.69,56.39 27.69,52.45 28.32,51.82 31.5,51.82 32.77,53.09 36.07,53.09 v36.96,53.98 | v51.94,57.78 52.58,57.78 54.1,56.26 v54.99,56.26
SD0  (via drill 0.61)
  Top 0.254: v54.99,51.69 44.7,51.69 43.56,50.55 42.93,50.55 42.29,49.91 42.29,48.9 US5.36
  Bottom 0.254: v54.99,51.69 56.64,53.34 69.85,53.34 US1.19
SD1  (via drill 0.61)
  Top 0.254: v42.04,51.44 41.66,51.05 41.66,48.9 US5.37 | v48.77,58.93 50.8,60.96 72.39,60.96 US1.20
  Bottom 0.254: v42.04,51.44 42.67,52.07 42.67,52.83 v48.77,58.93
SD2
  Top 0.254: US5.38 41.02,48.9 41.02,50.55 40.51,51.05 40.51,51.56 41.66,52.7 44.96,52.7 45.34,52.32 51.05,52.32 53.21,54.48 53.21,56.9 53.34,57.02 53.34,58.17 54.86,59.69 US1.21
SD3  (via drill 0.61)
  Top 0.254: v40.39,41.66 40.39,48.77 US5.39
  Bottom 0.254: v40.39,41.66 42.42,41.66 43.18,42.42 43.18,47.24 44.07,48.13 44.07,53.47 48.13,57.53 49.4,57.53 51.18,59.31 52.7,59.31 54.36,57.66 57.91,57.66 US1.22
SD4  (via drill 0.61)
  Top 0.254: US5.40 39.75,48.9 39.75,51.56 41.53,53.34 45.47,53.34 45.85,52.96 49.28,52.96 v51.69,55.37
  Bottom 0.254: v51.69,55.37 51.69,49.78 57.02,44.45 US1.27
SD5  (via drill 0.61)
  Top 0.254: US5.41 38.99,48.9 38.99,51.69 41.27,53.98 45.85,53.98 46.35,53.47 47.62,53.47 48.77,54.61 48.77,55.37 v49.4,56.01
  Bottom 0.254: US1.28 49.4,50.93 v49.4,56.01
SD6  (via drill 0.61)
  Top 0.254: v47.12,54.61 41.02,54.61 38.35,51.94 38.35,48.9 US5.42
  Bottom 0.254: US1.29 56.77,41.02 56.77,42.67 47.12,52.32 v47.12,54.61
SD7  (via drill 0.61)
  Top 0.254: US5.43 37.72,48.77 37.72,38.99 39.12,37.59 44.83,37.59 v44.96,37.47
  Bottom 0.254: v44.96,37.47 57.78,37.47 US1.30
TXD  (via drill 0.61)
  Top 0.254: v54.99,53.85 56.39,52.45 56.39,51.69 58.42,49.66 US1.25 | v26.92,49.4 v30.48,52.96
  Bottom 0.254: US2.11 24.89,40.01 24.26,40.64 24.26,46.74 v26.92,49.4 | v30.48,52.96 30.48,56.01 30.86,56.39 31.62,56.39 32.13,56.9 40.89,56.9 41.91,57.91 41.91,59.69 42.42,60.2 52.96,60.2 54.61,58.55 59.56,58.55 60.2,57.91 60.2,56.39 59.82,56.01 56.77,56.01 54.99,54.23 v54.99,53.85
VCC  (via drill 0.61)
  Top 0.254: US5.32 44.96,48.77 45.47,48.77 US5.31 45.59,48.77 45.59,43.94 v45.09,43.43 | 48.39,37.21 49.53,37.21 49.53,36.58 49.4,36.45 48.39,36.45 US5.15 | 48.39,37.21 US5.16 48.26,37.21 46.99,37.21 45.34,35.56 45.34,32 45.66,31.69 | 48.39,37.21 48.39,37.72 US5.17 48.26,37.85 46.74,37.85 46.35,38.23 46.35,38.61 v44.45,40.51 | R13.1 77.09,54.23 77.09,39.75 76.58,39.24 76.58,38.23 75.18,36.83 US1.11 70.36,36.83 67.94,34.42 61.09,34.42 US1.32 51.05,31.75 49.78,30.48 49.66,30.48 49.53,30.61 48.39,30.61 US5.6 48.26,30.61 46.74,30.61 45.66,31.69 | 31.94,42.74 35.18,45.97 35.18,48.77 US5.47 35.18,48.9 35.18,50.04 34.16,51.05 34.16,55.63 41.02,62.48 54.86,62.48 US4.8 59.82,64.64 69.34,64.64 70.99,66.29 R5.1 | 31.94,42.74 31.62,42.42 30.48,42.42 US5.57 | 40.39,21.59 40.39,17.78 | 40.39,17.78 v40.39,16 | 40.39,17.78 C16.2 | 40.39,21.59 40.39,22.99 40.26,23.11 38.99,23.11 38.35,23.75 38.35,24.77 US5.89 38.35,24.89 38.35,26.04 43.94,31.62 45.59,31.62 45.66,31.69 | 40.39,21.59 C13.2 | v28.57,33.66 28.96,33.66 29.21,33.91 30.35,33.91 US5.70 30.48,33.91 31.62,33.91 32.13,34.42 32.13,42.55 31.94,42.74 | C3.+ 17.91,1.14 24,1.14 24.07,1.21 | US3.OUT 24.07,1.21 | D2.A 73.53,1.14 24.13,1.14 24.07,1.21
  Bottom 0.254: 30.48,69.6 27.94,69.6 | 27.94,69.6 26.8,69.6 24.26,72.14 22.86,72.14 C11.1 | 27.94,69.6 C7.1 | 54.1,69.72 54.74,69.72 US4.8 | 54.1,69.72 53.09,69.72 | 53.09,69.72 R3.2 | C21.1 53.34,68.83 53.09,68.83 53.09,69.72 | 30.48,69.6 42.29,69.6 42.42,69.72 R3.2 | 30.48,69.6 C6.1 | R3.2 | C14.1 40.39,20.32 v40.39,16 33.02,16 32.96,16.07 | v28.57,33.66 US2.16 24.64,33.66 24.26,33.27 24.26,24.13 28.19,19.94 28.19,17.4 28.7,16.89 | R6.2 32.89,18.16 32.77,18.29 32.77,20.83 C15.1 | 32.89,16.89 R6.2 | 28.7,16.89 32.89,16.89 | R6.2 32.89,16.89 | 32.96,16.07 32.89,16.13 32.89,16.89 | US3.OUT 32.89,10.03 32.89,16 32.96,16.07 | R4.1 54.1,69.72 | 28.7,16.89 28.32,16.51 C2.1 26.04,16.53 26.04,17.65 24.51,19.18 C9.1 | v44.45,40.51 44.45,42.8 v45.09,43.43

### Text on the board
tNames: ACT | GND | 11 | 10 | 9 | 8 | 7 | 6 | 5 | 4 | 3 | 2 | 1 | PROG
bNames: AVT-953 / PCB by Urszula Stachowiak, 2020, rev. 1